# Altium schematic sheet PCB_Roomba.SchDoc
size A; SheetNumber: 1; SheetTotal: 1
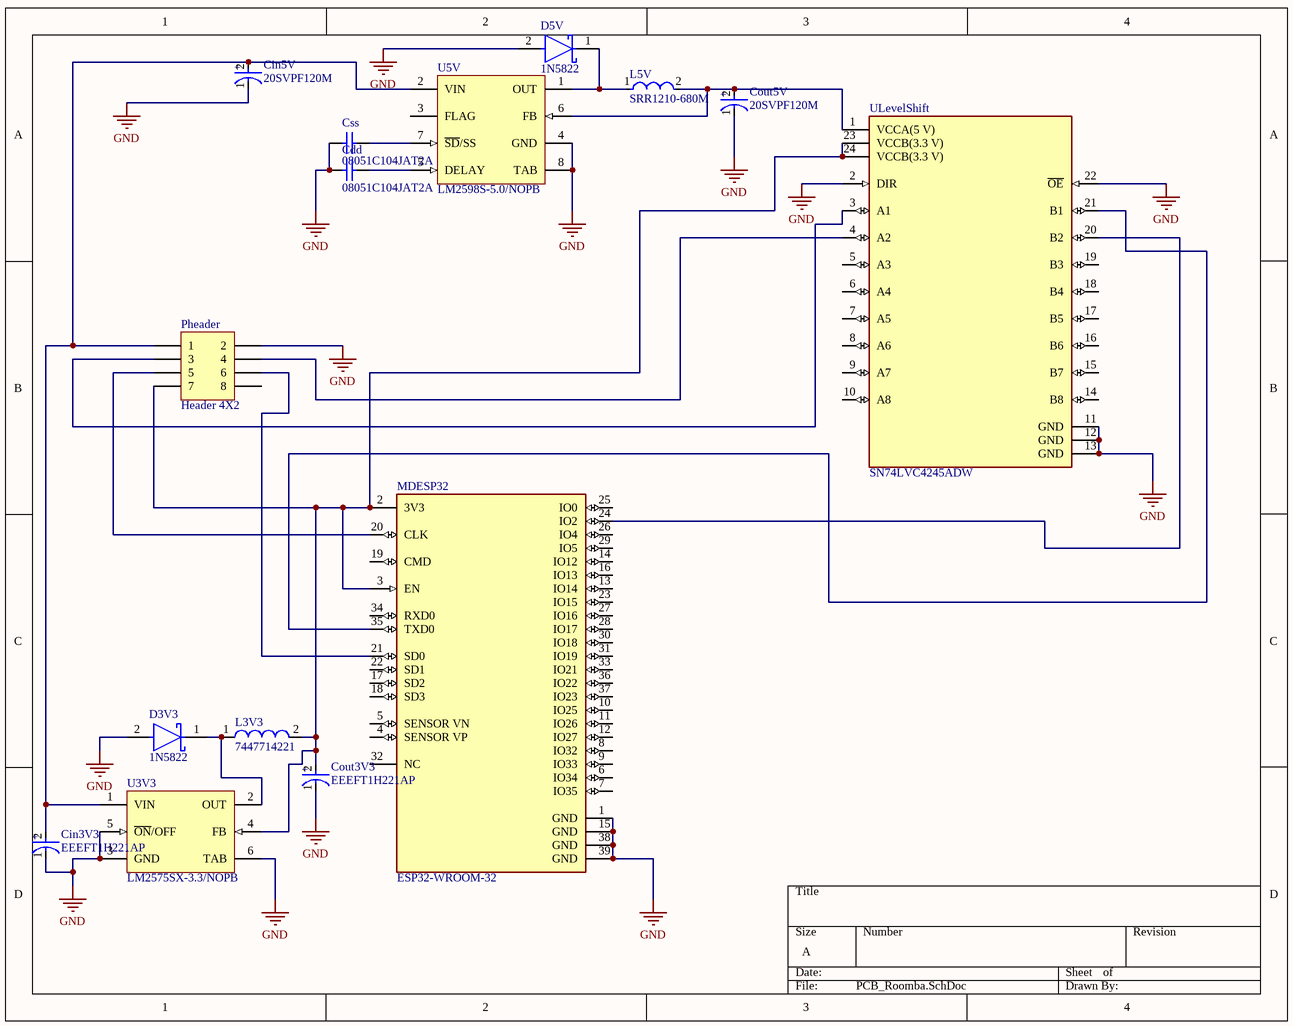
[diagram p0: PCB_Roomba.SchDoc]

## Parts
Cdd  08051C104JAT2A  [CAPC2013X94X50ML20T25]
Cin3V3  EEEFT1H221AP  [FP-FTF-MFG]
Cin5V  20SVPF120M  [FP-OS-CON-SMT-C6-MFG]
Cout3V3  EEEFT1H221AP  [FP-FTF-MFG]
Cout5V  20SVPF120M  [FP-OS-CON-SMT-C6-MFG]
Css  08051C104JAT2A  [CAPC2013X94X50ML20T25]
D3V3  1N5822  [FP-DO-201AD-MFG]
D5V  1N5822  [FP-DO-201AD-MFG]
L3V3  7447714221  [WE-PD 1050]
L5V  SRR1210-680M  [FP-SRR1210-MFG]
MDESP32  ESP32-WROOM-32  [FP-ESP32-WROOM-32-MFG]
Pheader  Header 4X2  [HDR2X4]
U3V3  LM2575SX-3.3/NOPB  [KTT0005B_L]
U5V  LM2598S-5.0/NOPB  [KTW0007B_N]
ULevelShift  SN74LVC4245ADW  [FP-DW0024A-MFG]

## Nets
GND: Cdd.1 Cin3V3.1(C) Cin5V.1(C) Cout3V3.1(C) Cout5V.1(C) Css.1 D3V3.2(A) D5V.2(A) MDESP32.1(GND) MDESP32.15(GND) MDESP32.38(GND) MDESP32.39(GND) Pheader.2 U3V3.3(GND) U3V3.5(~{ON}/OFF) U3V3.6(TAB) U5V.4(GND) U5V.8(TAB) ULevelShift.2(DIR) ULevelShift.11(GND) ULevelShift.12(GND) ULevelShift.13(GND) ULevelShift.22(~{OE})
NetCdd_2: Cdd.2 U5V.5(DELAY)
NetCin3V3_2: Cin3V3.2(A) Cin5V.2(A) Pheader.1 U3V3.1(VIN) U5V.2(VIN)
NetCout3V3_2: Cout3V3.2(A) L3V3.2 MDESP32.2(3V3) MDESP32.3(EN) Pheader.7 U3V3.4(FB) ULevelShift.23(VCCB(3.3_V)) ULevelShift.24(VCCB(3.3_V))
NetCout5V_2: Cout5V.2(A) L5V.2 U5V.6(FB) ULevelShift.1(VCCA(5_V))
NetCss_2: Css.2 U5V.7(~{SD}/SS)
NetD3V3_1: D3V3.1(C) L3V3.1 U3V3.2(OUT)
NetD5V_1: D5V.1(C) L5V.1 U5V.1(OUT)
NetMDESP32_20: MDESP32.20(CLK) Pheader.5
NetMDESP32_21: MDESP32.21(SD0) Pheader.6
NetMDESP32_24: MDESP32.24(IO2) ULevelShift.20(B2)
NetMDESP32_35: MDESP32.35(TXD0) ULevelShift.21(B1)
NetPheader_3: Pheader.3 ULevelShift.3(A1)
NetPheader_4: Pheader.4 ULevelShift.4(A2)

Not connected (* = marked no-connect by the designer): MDESP32 4(SENSOR_VP) 5(SENSOR_VN) 6(IO34) 7(IO35) 8(IO32) 9(IO33) 10(IO25) 11(IO26) 12(IO27) 13(IO14) 14(IO12) 16(IO13) 17(SD2) 18(SD3) 19(CMD) 22(SD1) 23(IO15) 25(IO0) 26(IO4) 27(IO16) 28(IO17) 29(IO5) 30(IO18) 31(IO19) 32(NC) 33(IO21) 34(RXD0) 36(IO22) 37(IO23); Pheader 8; U5V 3(FLAG); ULevelShift 5(A3) 6(A4) 7(A5) 8(A6) 9(A7) 10(A8) 14(B8) 15(B7) 16(B6) 17(B5) 18(B4) 19(B3)

## Notes on the sheet
- (in symbol CMP-05427-000092-1) +
- (in symbol CMP-05428-001333-1) +

## Library data of the parts
Cdd Css = CMP-1036-04427-2: Manufacturer: AVX Interconnect / Elco; Part Number: 08051C104JAT2A
Cin3V3 Cout3V3 = CMP-05427-000092-1: CAP ALUM 220UF 20% 50V SMD; Ripple Current (AC): 670mA; Dielectric Material: Aluminium; Life (Hours): 2000Hour; Leakage Current: 110uA; Lead Diameter: 0.9mm; ESR (Equivalent Series Resistance): 180mR; REACH SVHC: No SVHC; Voltage Rating (DC): 50V; Radiation Hardening: No; Capacitance: 220uF; Length: 10.2mm; Construction: Cylindrical; Case/Package: Radial; Series: FT; Lead Free: Lead Free; Voltage Rating: 50V; Tolerance: 20%; Contact Plating: Tin; Number of Pins: 2; Height - Seated (Max): 0.413inch; RoHS Compliant: Yes; Diameter: 8mm; Ripple Current: 670mA; Lead Pitch: 3.1mm; Termination: SMD/SMT; Mount: Surface Mount; Min Operating Temperature: -55°C; Max Operating Temperature: 105°C; Voltage: 50V; Height: 10.2mm; Package Quantity: 500; Packaging: Tape and Reel
Cin5V Cout5V = CMP-05428-001333-1: Conductive Polymer Aluminum Solid Capacitors (OS-CON) 120uF ±20% 20V; Polarity: Polar; ESR (Equivalent Series Resistance): 25mR; Leakage Current: 480uA; Ripple Current: 3.2A; Life (Hours): 5000Hour; Dissipation Factor: 12%; Lead Free: Lead Free; Voltage Rating: 20V; Packaging: Tape and Reel; Min Operating Temperature: -55°C; Tolerance: 20%; Diameter: 6.3mm; Max Operating Temperature: 105°C; Length: 5.9mm; Termination: SMD/SMT; Height - Seated (Max): 0.236inch; REACH SVHC: No SVHC; Voltage Rating (DC): 20V; Voltage: 20V; Material: Polymer; Ripple Current (AC): 3.2A; Series: OS-CON™, SVPF; RoHS Compliant: Yes; Mount: Surface Mount; Height: 5.9mm; Package Quantity: 1000; Radiation Hardening: No; Construction: Cylindrical; Case/Package: Radial; Capacitance: 120uF; Number of Pins: 6
D3V3 D5V = CMP-12187-000025-1: DIODE SCHOTTKY 40V 3A DO201AD; Manufacturer: STMicroelectronics; Max Junction Temp: +150°C; Peak Reverse Current: 2mA; Max Surge Forward Current: 80A; Temperature Range High: +150°C; Automotive: No; RoHS: TRUE; ComponentLink2Description: Datasheet; Manufacturer Part Number: 1N5822; Lead Free: Yes; Octopart: https://octopart.com/1n5822-stmicroelectronics-323225; Device Class L2: Diodes; Max Repetitive Reverse Voltage: 40V; Temperature: to +150°C; Height: 5.3mm; Category: Diode; Digikey Description: DIODE SCHOTTKY 40V 3A DO201AD; ComponentLink2URL: https://www.st.com/resource/en/datasheet/1n5822.pdf; Device Class L3: Schottky Diodes; Device Class L1: Discrete Semiconductors; Forward Current: 3A; Mouser Description: Schottky Diodes & Rectifiers Vr/40V Io/3A BULK; Package: DO-201AD
L3V3 = CMP-1396-00021-1: SMD-Shielded Power Inductor WE-PD, L=220 µH; Manufacturer: Wuerth Elektronik; Inductance: 220 ÂµH; PartNumber: 7447714221; ComponentLink1Description: Manufacturer URL; ComponentLink2URL: http://www.we-online.de/katalog/media/pdf/7447714221.pdf; ComponentLink1URL: http://www.we-online.com; PackageReference: WE-PD 1050; ComponentLink2Description: Datasheet
L5V = CMP-07248-000002-1: FIXED IND 68UH 3A 102 MOHM SMD; Manufacturer: Bourns; Shielding: true; Q Factor: 12; Series Resistance: 102mΩ; Saturation Current: 2.7A; Tolerance: 20%; Core Material: Ferrite; Self Resonant Frequency: 3.8MHz; Test Frequency: 2.52MHz; ComponentLink2Description: Datasheet; Inductance: 68uH; Rms Current: 3A; Device Class L3: Fixed Inductors; Lead Free: Yes; Composition: Wirewound; Value: 68uH; Temperature: -40°C to +125°C; Automotive: No; RoHS: TRUE; Category: Ind; Device Class L2: Inductors; Height: 10mm; Temperature Range Low: -40°C; Package: SRR1210; Device Class L1: Passive Components; Temperature Range High: +125°C; Mouser Description: Fixed Inductors 68uH 20% SMD 1210; ComponentLink2URL: https://www.bourns.com/docs/Product-Datasheets/SRR1210.pdf; Digikey Description: FIXED IND 68UH 3A 102 MOHM SMD; Octopart: https://octopart.com/srr1210-680m-bourns-10487145; Manufacturer Part Number: SRR1210-680M
MDESP32 = CMP-194065-000008-1: RX TXRX MOD WIFI SURFACE MOUNT; Frequency: 2.5GHz; Sensitivity: -98dBm; Operating Supply Voltage: 3.6V; Data Rate: 150Mbps; Weight: 0.088185oz; Package Quantity: 550; Min Operating Temperature: -40°C; Mount: Surface Mount; Max Operating Temperature: 85°C; Packaging: Cut Tape; Case/Package: SMD/SMT
Pheader = Header 4X2: Header, 4-Pin, Dual row; LatestRevisionDate: 17-Jul-2002; LatestRevisionNote: Re-released for DXP Platform.; Publisher: Altium Limited
U3V3 = CMP-0069-00081-3: SIMPLE SWITCHER® 1A Step-Down Voltage Regulator, 5-pin TO-263, Pb-Free; Manufacturer: Texas Instruments; PowerWise: N; PackageTopMarking: NSUZXYTTE#*LM2575S*-3.3 P+; RoHS: Y; PackageDescription: TO-263, Molded, .400 x .390 x .180in, 5 Lead, .067in Pitch, Surface Mount; PackageReference: KTT0005B; ComponentLink1URL: http://www.ti.com/general/docs/lit/getliterature.tsp?genericPartNumber=LM2575-N&fileType=pdf; ComponentLink1Description: Datasheet URL; CompType: Switcher; Code_JEDEC: MO-169-AB; PinCount: 5
U5V = CMP-0069-00280-3: SIMPLE SWITCHER® Power Converter 150 KHz 1A Step-Down Voltage Regulator with Features, 7-pin TO-263, Pb-Free; Manufacturer: Texas Instruments; PackageTopMarking: NSUZXYTTE#*LM2598S*-5.0 P+; PowerWise: N; RoHS: Y; PackageReference: KTW0007B; Code_JEDEC: MO-169-AC; CompType: Switcher; ComponentLink1URL: http://www.ti.com/general/docs/lit/getliterature.tsp?genericPartNumber=LM2598&fileType=pdf; PackageDescription: TO-263, Molded, .400 x .390 x .180in Body, 7 Lead, .050in Pitch, Surface Mount; ComponentLink1Description: Datasheet URL; PinCount: 7
ULevelShift = CMP-04899-000091-1: IC TRNSLTR BIDIRECTIONAL 24SOIC; Number of Bits: 8; Low Level Output Current: 24mA; Output Type: Voltage; Propagation Delay: 9.8ns; Min Supply Voltage: 4.5V; Number of Elements: 1; Turn-On Delay Time: 6.7ns; Max Supply Current: 80uA; Max Supply Voltage: 5.5V; Polarity: Non-Inverting; Logic Function: Translator; Operating Supply Voltage: 5V; High Level Output Current: -24mA; Case/Package: SOIC; Height: 2.35mm; Width: 7.52mm; Number of Pins: 24; Weight: 0.022025oz; Lead Free: Lead Free; Packaging: Rail/Tube; Number of Channels: 8; Series: 74LVC; REACH SVHC: No SVHC; RoHS Compliant: Yes; Mount: Surface Mount; Length: 15.4mm; Package Quantity: 25; Radiation Hardening: No; Contact Plating: Gold; Quiescent Current: 80uA; Max Operating Temperature: 85°C; Direction: Bidirectional; Number of Outputs: 8; Technology: CMOS; Min Operating Temperature: -40°C; Number of Circuits: 8